# EAGLE schematic weather-cube_sensor_sht31d (EAGLE 7.3.0)
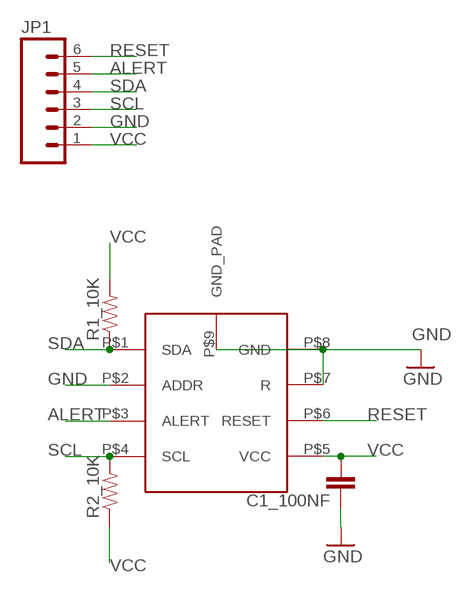
[diagram p0: schematic, sheet 1]

## Parts
C1_100NF  CAP0603-CAP  [0603-CAP]
JP1  M06SILK_FEMALE_PTH  [1X06]
R1_10K  RESISTOR0603-RES  [0603-RES]
R2_10K  RESISTOR0603-RES  [0603-RES]
U$1  SHT31-D  [SHT31-D]

## Nets
ALERT: JP1.5 U$1.P$3(ALERT)
GND: C1_100NF.1 JP1.2 U$1.P$2(ADDR) U$1.P$7(R) U$1.P$8(GND) U$1.P$9(GND_PAD)
RESET: JP1.6 U$1.P$6(RESET)
SCL: JP1.3 R2_10K.2 U$1.P$4(SCL)
SDA: JP1.4 R1_10K.1 U$1.P$1(SDA)
VCC: C1_100NF.2 JP1.1 R1_10K.2 R2_10K.1 U$1.P$5(VCC)

## Library data of the parts
C1_100NF = SparkFun-Passives:CAP: Capacitor Standard 0603 ceramic capacitor, and 0.1" leaded capacitor.
JP1 = SparkFun-Connectors:M06: Header 6 Standard 6-pin 0.1" header. Use with straight break away headers (SKU : PRT-00116), right angle break away headers (PRT-00553), swiss pins (PRT-00743), machine pins (PRT-00117), and female headers (PRT-00115). Molex polarized connector foot print use with SKU : PRT-08094 with associated crimp pins and housings. NOTES ON THE VARIANTS LOCK and LOCK_LONGPADS... This footprint was designed to help hold the alignment of a through-hole component (i.e. 6-pin header) while soldering it into place. You may notice that each hole has been shifted either up or down by 0.005 of an inch from it's more standard position (which is a perfectly straight line). This slight alteration caused the pins (the squares in the middle) to touch the edges of the holes. Because they are alternating, it causes a "brace" to hold the component in place. 0.005 has proven to be the perfect amount of "off-center" position when using our standard breakaway headers. Although looks a little odd when you look at the bare footprint, once you have a header in there, the alteration is very hard to notice. Also,if you push a header all the way into place, it is covered up entirely on the bottom side. This idea of altering the position of holes to aid alignment will be further integrated into the Sparkfun Library for other footprints. It can help hold any component with 3 or more connection pins.; PROD_ID: CONN-08437
R1_10K R2_10K = SparkFun-Passives:RESISTOR: Resistor Basic schematic elements and footprints for 0603, 1206, and PTH resistors.
U$1 = awqua_eagle_library:SHT31-D